# Altium schematic sheet УШЯИ.411618.029Э Э3 Лист 1.schdoc (part 2 of 3)
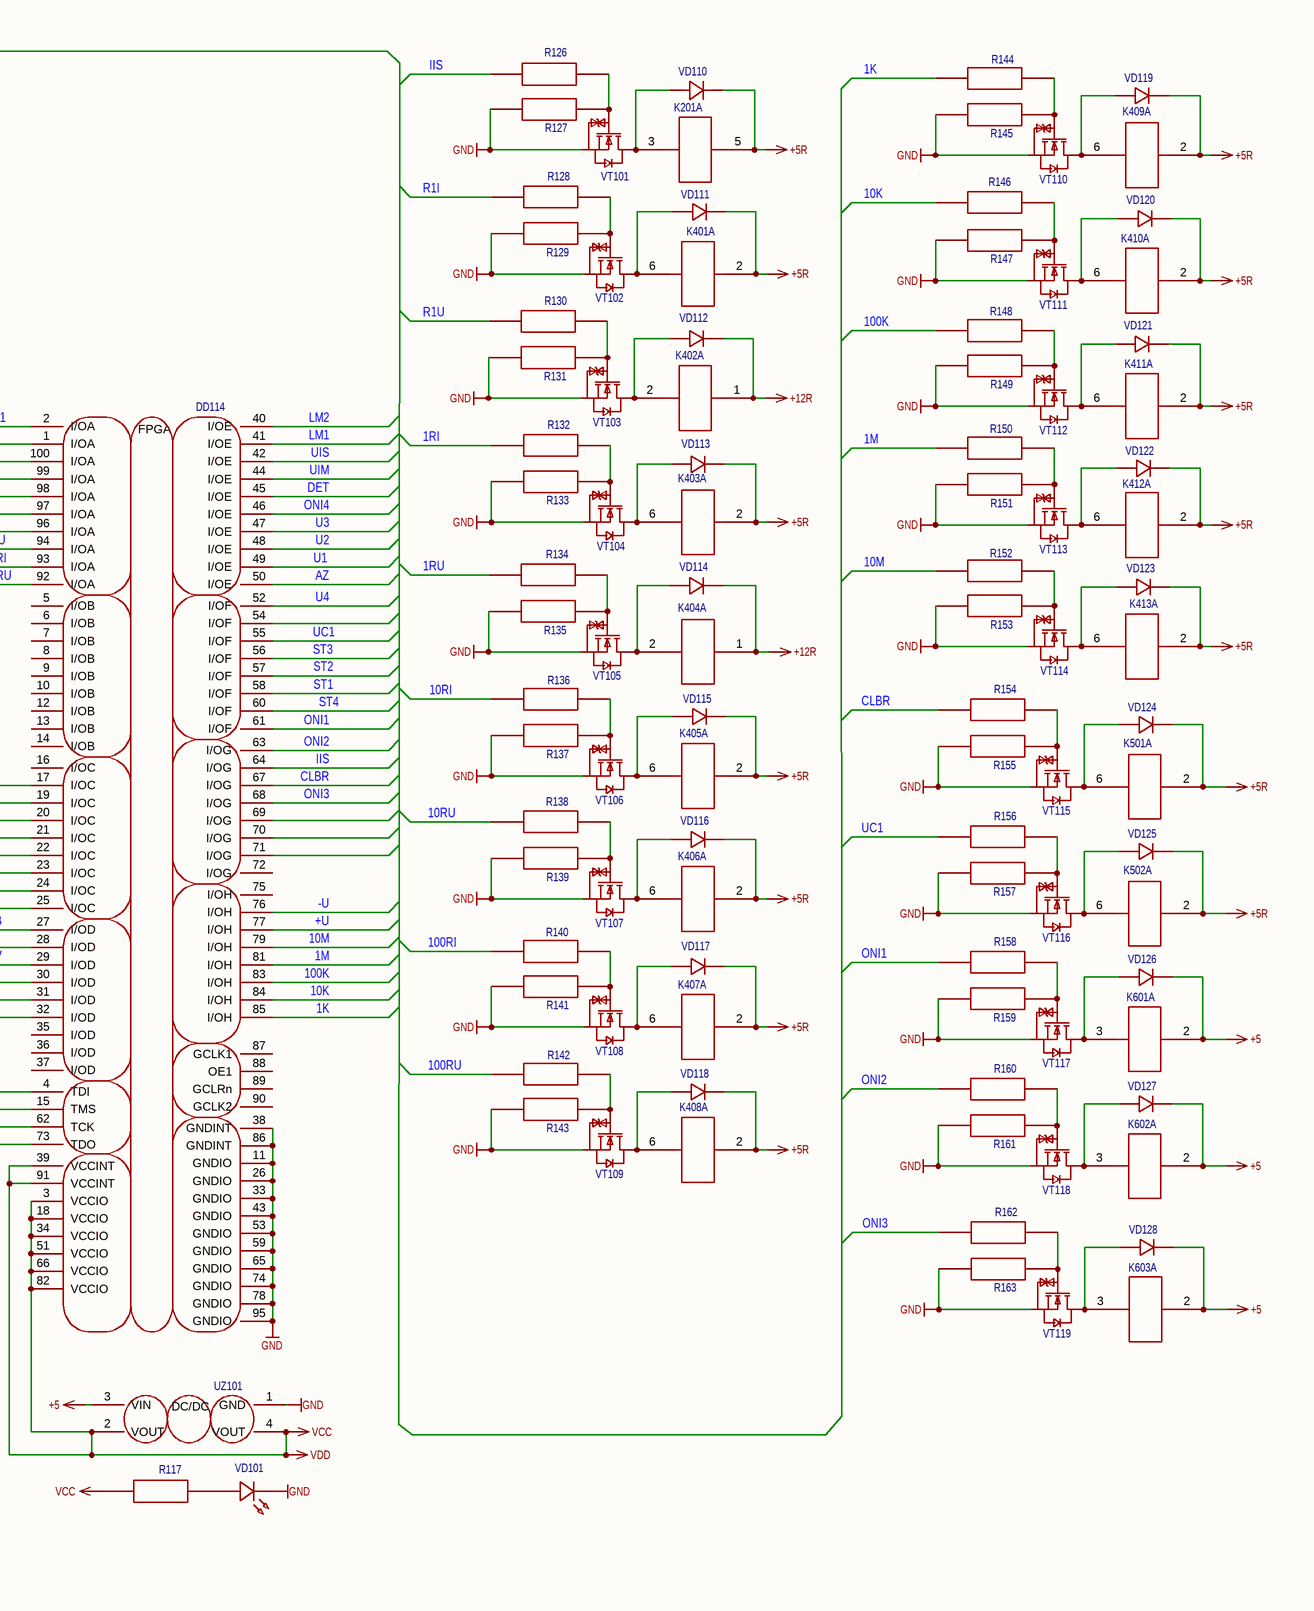
[diagram p2: УШЯИ.411618.029Э Э3 Лист 1.schdoc, right]
## Library data of the parts
C101 = Конденсатор SMD 100нФ 100В X7R 10% [0805]: Contributor: jordanjin; Convert to PCB: yes; UniqueId: gge50a601ba36169810; Origin Footprint: C0805; Device: Конденсатор SMD 100нФ 100В X7R 10% [0805]; Symbol: Конденсатор SMD 100нФ 100В X7R 10% [0805]; Manufacturer Part: C0805; spicePre: C; spiceSymbolName: Конденсатор SMD 100нФ 100В X7R 10% [0805]; Add into BOM: yes; FootprintName: C0805
C102 = Конденсатор SMD 100нФ 100В X7R 10% [0805]: Contributor: jordanjin; Convert to PCB: yes; UniqueId: gge94e2ea0e3b3374a7; Origin Footprint: C0805; Device: Конденсатор SMD 100нФ 100В X7R 10% [0805]; Symbol: Конденсатор SMD 100нФ 100В X7R 10% [0805]; Manufacturer Part: C0805; spicePre: C; spiceSymbolName: Конденсатор SMD 100нФ 100В X7R 10% [0805]; Add into BOM: yes; FootprintName: C0805
C103 = Конденсатор SMD 100нФ 100В X7R 10% [0805]: Contributor: jordanjin; Convert to PCB: yes; UniqueId: ggedacb5201c4a5c4e2; Origin Footprint: C0805; Device: Конденсатор SMD 100нФ 100В X7R 10% [0805]; Symbol: Конденсатор SMD 100нФ 100В X7R 10% [0805]; Manufacturer Part: C0805; spicePre: C; spiceSymbolName: Конденсатор SMD 100нФ 100В X7R 10% [0805]; Add into BOM: yes; FootprintName: C0805
C104 = Конденсатор SMD 100нФ 100В X7R 10% [0805]: Contributor: jordanjin; Convert to PCB: yes; UniqueId: gge34eda7cf9e9ee0fb; Origin Footprint: C0805; Device: Конденсатор SMD 100нФ 100В X7R 10% [0805]; Symbol: Конденсатор SMD 100нФ 100В X7R 10% [0805]; Manufacturer Part: C0805; spicePre: C; spiceSymbolName: Конденсатор SMD 100нФ 100В X7R 10% [0805]; Add into BOM: yes; FootprintName: C0805
C105 = Конденсатор SMD 100нФ 100В X7R 10% [0805]: Contributor: jordanjin; Convert to PCB: yes; UniqueId: gge25c71510294cab0d; Origin Footprint: C0805; Device: Конденсатор SMD 100нФ 100В X7R 10% [0805]; Symbol: Конденсатор SMD 100нФ 100В X7R 10% [0805]; Manufacturer Part: C0805; spicePre: C; spiceSymbolName: Конденсатор SMD 100нФ 100В X7R 10% [0805]; Add into BOM: yes; FootprintName: C0805
C106 = Конденсатор SMD 100нФ 100В X7R 10% [0805]: Contributor: jordanjin; Convert to PCB: yes; UniqueId: gge49d087e124082ea0; Origin Footprint: C0805; Device: Конденсатор SMD 100нФ 100В X7R 10% [0805]; Symbol: Конденсатор SMD 100нФ 100В X7R 10% [0805]; Manufacturer Part: C0805; spicePre: C; spiceSymbolName: Конденсатор SMD 100нФ 100В X7R 10% [0805]; Add into BOM: yes; FootprintName: C0805
C107 = Конденсатор SMD 100нФ 100В X7R 10% [0805]: Contributor: jordanjin; Convert to PCB: yes; UniqueId: gge50cb57ab95e02ebe; Origin Footprint: C0805; Device: Конденсатор SMD 100нФ 100В X7R 10% [0805]; Symbol: Конденсатор SMD 100нФ 100В X7R 10% [0805]; Manufacturer Part: C0805; spicePre: C; spiceSymbolName: Конденсатор SMD 100нФ 100В X7R 10% [0805]; Add into BOM: yes; FootprintName: C0805
C108 = Конденсатор SMD 100нФ 100В X7R 10% [0805]: Contributor: jordanjin; Convert to PCB: yes; UniqueId: gged933a6a0350d5a04; Origin Footprint: C0805; Device: Конденсатор SMD 100нФ 100В X7R 10% [0805]; Symbol: Конденсатор SMD 100нФ 100В X7R 10% [0805]; Manufacturer Part: C0805; spicePre: C; spiceSymbolName: Конденсатор SMD 100нФ 100В X7R 10% [0805]; Add into BOM: yes; FootprintName: C0805
C109 = Конденсатор SMD 100нФ 100В X7R 10% [0805]: Contributor: jordanjin; Convert to PCB: yes; UniqueId: gge27962ba85defdf79; Origin Footprint: C0805; Device: Конденсатор SMD 100нФ 100В X7R 10% [0805]; Symbol: Конденсатор SMD 100нФ 100В X7R 10% [0805]; Manufacturer Part: C0805; spicePre: C; spiceSymbolName: Конденсатор SMD 100нФ 100В X7R 10% [0805]; Add into BOM: yes; FootprintName: C0805
C110 = Конденсатор SMD 100нФ 100В X7R 10% [0805]: Contributor: jordanjin; Convert to PCB: yes; UniqueId: gge612c97588fe9464b; Origin Footprint: C0805; Device: Конденсатор SMD 100нФ 100В X7R 10% [0805]; Symbol: Конденсатор SMD 100нФ 100В X7R 10% [0805]; Manufacturer Part: C0805; spicePre: C; spiceSymbolName: Конденсатор SMD 100нФ 100В X7R 10% [0805]; Add into BOM: yes; FootprintName: C0805
C111 = Конденсатор SMD 100нФ 100В X7R 10% [0805]: Contributor: jordanjin; Convert to PCB: yes; UniqueId: gge2f7a6f25e128a448; Origin Footprint: C0805; Device: Конденсатор SMD 100нФ 100В X7R 10% [0805]; Symbol: Конденсатор SMD 100нФ 100В X7R 10% [0805]; Manufacturer Part: C0805; spicePre: C; spiceSymbolName: Конденсатор SMD 100нФ 100В X7R 10% [0805]; Add into BOM: yes; FootprintName: C0805
C112 = Конденсатор SMD 100нФ 100В X7R 10% [0805]: Contributor: jordanjin; Convert to PCB: yes; UniqueId: gge7a76c4b2d63205ed; Origin Footprint: C0805; Device: Конденсатор SMD 100нФ 100В X7R 10% [0805]; Symbol: Конденсатор SMD 100нФ 100В X7R 10% [0805]; Manufacturer Part: C0805; spicePre: C; spiceSymbolName: Конденсатор SMD 100нФ 100В X7R 10% [0805]; Add into BOM: yes; FootprintName: C0805
C113 = Конденсатор SMD 100нФ 100В X7R 10% [0805]: Contributor: jordanjin; Convert to PCB: yes; UniqueId: gge1b835d6c60b435b0; Origin Footprint: C0805; Device: Конденсатор SMD 100нФ 100В X7R 10% [0805]; Symbol: Конденсатор SMD 100нФ 100В X7R 10% [0805]; Manufacturer Part: C0805; spicePre: C; spiceSymbolName: Конденсатор SMD 100нФ 100В X7R 10% [0805]; Add into BOM: yes; FootprintName: C0805
C114 = Конденсатор SMD 100нФ 100В X7R 10% [0805]: Contributor: jordanjin; Convert to PCB: yes; UniqueId: gged3422836171095bd; Origin Footprint: C0805; Device: Конденсатор SMD 100нФ 100В X7R 10% [0805]; Symbol: Конденсатор SMD 100нФ 100В X7R 10% [0805]; Manufacturer Part: C0805; spicePre: C; spiceSymbolName: Конденсатор SMD 100нФ 100В X7R 10% [0805]; Add into BOM: yes; FootprintName: C0805
C115 = Конденсатор SMD 100нФ 100В X7R 10% [0805]: Contributor: jordanjin; Convert to PCB: yes; UniqueId: gge559d8560901f254c; Origin Footprint: C0805; Device: Конденсатор SMD 100нФ 100В X7R 10% [0805]; Symbol: Конденсатор SMD 100нФ 100В X7R 10% [0805]; Manufacturer Part: C0805; spicePre: C; spiceSymbolName: Конденсатор SMD 100нФ 100В X7R 10% [0805]; Add into BOM: yes; FootprintName: C0805
C116 = Конденсатор SMD 100нФ 100В X7R 10% [0805]: Contributor: jordanjin; Convert to PCB: yes; UniqueId: ggec511750cb831a988; Origin Footprint: C0805; Device: Конденсатор SMD 100нФ 100В X7R 10% [0805]; Symbol: Конденсатор SMD 100нФ 100В X7R 10% [0805]; Manufacturer Part: C0805; spicePre: C; spiceSymbolName: Конденсатор SMD 100нФ 100В X7R 10% [0805]; Add into BOM: yes; FootprintName: C0805
C117 = Конденсатор SMD 100нФ 100В X7R 10% [0805]: Contributor: jordanjin; Convert to PCB: yes; UniqueId: gge492dbba8a9d90766; Origin Footprint: C0805; Device: Конденсатор SMD 100нФ 100В X7R 10% [0805]; Symbol: Конденсатор SMD 100нФ 100В X7R 10% [0805]; Manufacturer Part: C0805; spicePre: C; spiceSymbolName: Конденсатор SMD 100нФ 100В X7R 10% [0805]; Add into BOM: yes; FootprintName: C0805
C118 = Конденсатор SMD 100нФ 100В X7R 10% [0805]: Contributor: jordanjin; Convert to PCB: yes; UniqueId: ggedc3a872f3d7bf9b6; Origin Footprint: C0805; Device: Конденсатор SMD 100нФ 100В X7R 10% [0805]; Symbol: Конденсатор SMD 100нФ 100В X7R 10% [0805]; Manufacturer Part: C0805; spicePre: C; spiceSymbolName: Конденсатор SMD 100нФ 100В X7R 10% [0805]; Add into BOM: yes; FootprintName: C0805
C119 = Конденсатор SMD 100нФ 100В X7R 10% [0805]: Contributor: jordanjin; Convert to PCB: yes; UniqueId: ggea50e830354660b01; Origin Footprint: C0805; Device: Конденсатор SMD 100нФ 100В X7R 10% [0805]; Symbol: Конденсатор SMD 100нФ 100В X7R 10% [0805]; Manufacturer Part: C0805; spicePre: C; spiceSymbolName: Конденсатор SMD 100нФ 100В X7R 10% [0805]; Add into BOM: yes; FootprintName: C0805
C120 = Конденсатор SMD 100нФ 100В X7R 10% [0805]: Contributor: jordanjin; Convert to PCB: yes; UniqueId: gge9590b5d8379a1919; Origin Footprint: C0805; Device: Конденсатор SMD 100нФ 100В X7R 10% [0805]; Symbol: Конденсатор SMD 100нФ 100В X7R 10% [0805]; Manufacturer Part: C0805; spicePre: C; spiceSymbolName: Конденсатор SMD 100нФ 100В X7R 10% [0805]; Add into BOM: yes; FootprintName: C0805
C121 = Конденсатор SMD 100нФ 100В X7R 10% [0805]: Contributor: jordanjin; Convert to PCB: yes; UniqueId: gge63b3ddf0ade3641d; Origin Footprint: C0805; Device: Конденсатор SMD 100нФ 100В X7R 10% [0805]; Symbol: Конденсатор SMD 100нФ 100В X7R 10% [0805]; Manufacturer Part: C0805; spicePre: C; spiceSymbolName: Конденсатор SMD 100нФ 100В X7R 10% [0805]; Add into BOM: yes; FootprintName: C0805
C122 = Конденсатор SMD 100нФ 100В X7R 10% [0805]: Contributor: jordanjin; Convert to PCB: yes; UniqueId: ggeb83b43dba428f6ef; Origin Footprint: C0805; Device: Конденсатор SMD 100нФ 100В X7R 10% [0805]; Symbol: Конденсатор SMD 100нФ 100В X7R 10% [0805]; Manufacturer Part: C0805; spicePre: C; spiceSymbolName: Конденсатор SMD 100нФ 100В X7R 10% [0805]; Add into BOM: yes; FootprintName: C0805
C123 = Конденсатор SMD 100нФ 100В X7R 10% [0805]: Contributor: jordanjin; Convert to PCB: yes; UniqueId: ggea2a125f1a1054dbe; Origin Footprint: C0805; Device: Конденсатор SMD 100нФ 100В X7R 10% [0805]; Symbol: Конденсатор SMD 100нФ 100В X7R 10% [0805]; Manufacturer Part: C0805; spicePre: C; spiceSymbolName: Конденсатор SMD 100нФ 100В X7R 10% [0805]; Add into BOM: yes; FootprintName: C0805
C124 = Конденсатор SMD 100нФ 100В X7R 10% [0805]: Contributor: jordanjin; Convert to PCB: yes; UniqueId: gge87e42572fc320fa7; Origin Footprint: C0805; Device: Конденсатор SMD 100нФ 100В X7R 10% [0805]; Symbol: Конденсатор SMD 100нФ 100В X7R 10% [0805]; Manufacturer Part: C0805; spicePre: C; spiceSymbolName: Конденсатор SMD 100нФ 100В X7R 10% [0805]; Add into BOM: yes; FootprintName: C0805
C125 = Конденсатор SMD 100нФ 100В X7R 10% [0805]: Contributor: jordanjin; Convert to PCB: yes; UniqueId: ggea9bf1272ff874ec4; Origin Footprint: C0805; Device: Конденсатор SMD 100нФ 100В X7R 10% [0805]; Symbol: Конденсатор SMD 100нФ 100В X7R 10% [0805]; Manufacturer Part: C0805; spicePre: C; spiceSymbolName: Конденсатор SMD 100нФ 100В X7R 10% [0805]; Add into BOM: yes; FootprintName: C0805
C126 = Конденсатор SMD 100нФ 100В X7R 10% [0805]: Contributor: jordanjin; Convert to PCB: yes; UniqueId: ggec79572819af15c76; Origin Footprint: C0805; Device: Конденсатор SMD 100нФ 100В X7R 10% [0805]; Symbol: Конденсатор SMD 100нФ 100В X7R 10% [0805]; Manufacturer Part: C0805; spicePre: C; spiceSymbolName: Конденсатор SMD 100нФ 100В X7R 10% [0805]; Add into BOM: yes; FootprintName: C0805
C127 = TECAP, 100мкФ, 10В, тип C: Manufacturer: Kyocera AVX; nameAlias: Value; Contributor: jordanjin; Convert to PCB: yes; UniqueId: gge1274122329830bad; Origin Footprint: CASE-C_6032; Device: TECAP, 100мкФ, 10В, тип C; Symbol: TECAP, 100мкФ, 10В, тип C; Supplier: LCSC; Supplier Part: C273664; Manufacturer Part: TECAP, 100мкФ, 10В, тип C; JLCPCB Part Class: Extended Part; spicePre: C; spiceSymbolName: TECAP, 100мкФ, 10В, тип C; Add into BOM: yes; FootprintName: CASE-C_6032
C128 = Конденсатор SMD 10мкФ 100В X7R 10% [0805]: Contributor: jordanjin; Convert to PCB: yes; UniqueId: gge114f7bd3638c32e8; Origin Footprint: C0805; Device: Конденсатор SMD 10мкФ 100В X7R 10% [0805]; Symbol: Конденсатор SMD 10мкФ 100В X7R 10% [0805]; Manufacturer Part: C0805; spicePre: C; spiceSymbolName: Конденсатор SMD 100нФ 100В X7R 10% [0805]; Add into BOM: yes; FootprintName: C0805
C129 = Конденсатор SMD 100нФ 100В X7R 10% [0805]: Contributor: jordanjin; Convert to PCB: yes; UniqueId: ggeb629d3a449f0ebd6; Origin Footprint: C0805; Device: Конденсатор SMD 100нФ 100В X7R 10% [0805]; Symbol: Конденсатор SMD 100нФ 100В X7R 10% [0805]; Manufacturer Part: C0805; spicePre: C; spiceSymbolName: Конденсатор SMD 100нФ 100В X7R 10% [0805]; Add into BOM: yes; FootprintName: C0805
C130 = Конденсатор SMD 100нФ 100В X7R 10% [0805]: Contributor: jordanjin; Convert to PCB: yes; UniqueId: gge720601326cec92c7; Origin Footprint: C0805; Device: Конденсатор SMD 100нФ 100В X7R 10% [0805]; Symbol: Конденсатор SMD 100нФ 100В X7R 10% [0805]; Manufacturer Part: C0805; spicePre: C; spiceSymbolName: Конденсатор SMD 100нФ 100В X7R 10% [0805]; Add into BOM: yes; FootprintName: C0805
C131 = Конденсатор SMD 100нФ 100В X7R 10% [0805]: Contributor: jordanjin; Convert to PCB: yes; UniqueId: gge93f31df730ba0f33; Origin Footprint: C0805; Device: Конденсатор SMD 100нФ 100В X7R 10% [0805]; Symbol: Конденсатор SMD 100нФ 100В X7R 10% [0805]; Manufacturer Part: C0805; spicePre: C; spiceSymbolName: Конденсатор SMD 100нФ 100В X7R 10% [0805]; Add into BOM: yes; FootprintName: C0805
C132 = Конденсатор SMD 100нФ 100В X7R 10% [0805]: Contributor: jordanjin; Convert to PCB: yes; UniqueId: ggeb7d0df687c6811f3; Origin Footprint: C0805; Device: Конденсатор SMD 100нФ 100В X7R 10% [0805]; Symbol: Конденсатор SMD 100нФ 100В X7R 10% [0805]; Manufacturer Part: C0805; spicePre: C; spiceSymbolName: Конденсатор SMD 100нФ 100В X7R 10% [0805]; Add into BOM: yes; FootprintName: C0805
C133 = Конденсатор SMD 100нФ 100В X7R 10% [0805]: Contributor: jordanjin; Convert to PCB: yes; UniqueId: ggeda150ecc94310c71; Origin Footprint: C0805; Device: Конденсатор SMD 100нФ 100В X7R 10% [0805]; Symbol: Конденсатор SMD 100нФ 100В X7R 10% [0805]; Manufacturer Part: C0805; spicePre: C; spiceSymbolName: Конденсатор SMD 100нФ 100В X7R 10% [0805]; Add into BOM: yes; FootprintName: C0805
C134 = Конденсатор SMD 100нФ 100В X7R 10% [0805]: Contributor: jordanjin; Convert to PCB: yes; UniqueId: gge45b133ad58b3c6cc; Origin Footprint: C0805; Device: Конденсатор SMD 100нФ 100В X7R 10% [0805]; Symbol: Конденсатор SMD 100нФ 100В X7R 10% [0805]; Manufacturer Part: C0805; spicePre: C; spiceSymbolName: Конденсатор SMD 100нФ 100В X7R 10% [0805]; Add into BOM: yes; FootprintName: C0805
C135 = Конденсатор SMD 100нФ 100В X7R 10% [0805]: Contributor: jordanjin; Convert to PCB: yes; UniqueId: gge8cfa1b9352ccbfc1; Origin Footprint: C0805; Device: Конденсатор SMD 100нФ 100В X7R 10% [0805]; Symbol: Конденсатор SMD 100нФ 100В X7R 10% [0805]; Manufacturer Part: C0805; spicePre: C; spiceSymbolName: Конденсатор SMD 100нФ 100В X7R 10% [0805]; Add into BOM: yes; FootprintName: C0805
C136 = Конденсатор SMD 100нФ 100В X7R 10% [0805]: Contributor: jordanjin; Convert to PCB: yes; UniqueId: gge177eba0eb34f5c30; Origin Footprint: C0805; Device: Конденсатор SMD 100нФ 100В X7R 10% [0805]; Symbol: Конденсатор SMD 100нФ 100В X7R 10% [0805]; Manufacturer Part: C0805; spicePre: C; spiceSymbolName: Конденсатор SMD 100нФ 100В X7R 10% [0805]; Add into BOM: yes; FootprintName: C0805
DD101 = Изолированный приемопередатчик ADM2486BRWZ-REEL [SOIC-16]: Manufacturer: Analog Devices; Contributor: jordanjin; Convert to PCB: yes; UniqueId: gge280670cf599e4aa0; Origin Footprint: SOIC-16_L10.3-W7.5-P1.27-LS10.3-BL; Device: Изолированный приемопередатчик ADM2486BRWZ-REEL [SOIC-16]; Symbol: Изолированный приемопередатчик ADM2486BRWZ-REEL [SOIC-16]; Supplier: LCSC; Manufacturer Part: ADM2486BRWZ-REEL; JLCPCB Part Class: Extended Part; spicePre: D; spiceSymbolName: ADM2486BRWZ-REEL; Add into BOM: yes; FootprintName: SOIC-16_L10.3-W7.5-P1.27-LS10.3-BL
DD102 = Изолированный приемопередатчик ADM2486BRWZ-REEL [SOIC-16]: Manufacturer: Analog Devices; Contributor: jordanjin; Convert to PCB: yes; UniqueId: ggee281b66250e43b86; Origin Footprint: SOIC-16_L10.3-W7.5-P1.27-LS10.3-BL; Device: Изолированный приемопередатчик ADM2486BRWZ-REEL [SOIC-16]; Symbol: Изолированный приемопередатчик ADM2486BRWZ-REEL [SOIC-16]; Supplier: LCSC; Manufacturer Part: ADM2486BRWZ-REEL; JLCPCB Part Class: Extended Part; spicePre: D; spiceSymbolName: ADM2486BRWZ-REEL; Add into BOM: yes; FootprintName: SOIC-16_L10.3-W7.5-P1.27-LS10.3-BL
DD103 = Высокоскоростной цифровой изолятор ADUM1100BRZ-RL7 [SOIC-8]: Manufacturer: Analog Devices; Manufacturer Part: ADUM1100ARZ; Contributor: jordanjin; Convert to PCB: yes; UniqueId: gged390e51bf4fd7430; Origin Footprint: SOIC-8_L4.9-W3.9-P1.27-LS6.0-BL; Device: Высокоскоростной цифровой изолятор ADUM1100BRZ-RL7 [SOIC-8]; Symbol: Высокоскоростной цифровой изолятор ADUM1100BRZ-RL7 [SOIC-8]; Supplier: LCSC; JLCPCB Part Class: Extended Part; spicePre: D; spiceSymbolName: Высокоскоростной цифровой изолятор ADUM1100BRZ-RL7 [SOIC-8]; Add into BOM: yes; FootprintName: SOIC-8_L4.9-W3.9-P1.27-LS6.0-BL
DD104 = Высокоскоростной цифровой изолятор ADUM1100BRZ-RL7 [SOIC-8]: Manufacturer: Analog Devices; Manufacturer Part: ADUM1100ARZ; Contributor: jordanjin; Convert to PCB: yes; UniqueId: ggefa5c6f2ce462c50e; Origin Footprint: SOIC-8_L4.9-W3.9-P1.27-LS6.0-BL; Device: Высокоскоростной цифровой изолятор ADUM1100BRZ-RL7 [SOIC-8]; Symbol: Высокоскоростной цифровой изолятор ADUM1100BRZ-RL7 [SOIC-8]; Supplier: LCSC; JLCPCB Part Class: Extended Part; spicePre: D; spiceSymbolName: Высокоскоростной цифровой изолятор ADUM1100BRZ-RL7 [SOIC-8]; Add into BOM: yes; FootprintName: SOIC-8_L4.9-W3.9-P1.27-LS6.0-BL
DD105 = Высокоскоростной цифровой изолятор ADUM1100BRZ-RL7 [SOIC-8]: Manufacturer: Analog Devices; Manufacturer Part: ADUM1100ARZ; Contributor: jordanjin; Convert to PCB: yes; UniqueId: gge7937ef05f563b8cc; Origin Footprint: SOIC-8_L4.9-W3.9-P1.27-LS6.0-BL; Device: Высокоскоростной цифровой изолятор ADUM1100BRZ-RL7 [SOIC-8]; Symbol: Высокоскоростной цифровой изолятор ADUM1100BRZ-RL7 [SOIC-8]; Supplier: LCSC; JLCPCB Part Class: Extended Part; spicePre: D; spiceSymbolName: Высокоскоростной цифровой изолятор ADUM1100BRZ-RL7 [SOIC-8]; Add into BOM: yes; FootprintName: SOIC-8_L4.9-W3.9-P1.27-LS6.0-BL
DD106 = Изолированный приемопередатчик ADM2486BRWZ-REEL [SOIC-16]: Manufacturer: Analog Devices; Contributor: jordanjin; Convert to PCB: yes; UniqueId: gge233945d82e3d21a8; Origin Footprint: SOIC-16_L10.3-W7.5-P1.27-LS10.3-BL; Device: Изолированный приемопередатчик ADM2486BRWZ-REEL [SOIC-16]; Symbol: Изолированный приемопередатчик ADM2486BRWZ-REEL [SOIC-16]; Supplier: LCSC; Manufacturer Part: ADM2486BRWZ-REEL; JLCPCB Part Class: Extended Part; spicePre: D; spiceSymbolName: ADM2486BRWZ-REEL; Add into BOM: yes; FootprintName: SOIC-16_L10.3-W7.5-P1.27-LS10.3-BL
DD107 = Изолированный приемопередатчик ADM2486BRWZ-REEL [SOIC-16]: Manufacturer: Analog Devices; Contributor: jordanjin; Convert to PCB: yes; UniqueId: ggebc0a98823a54ad10; Origin Footprint: SOIC-16_L10.3-W7.5-P1.27-LS10.3-BL; Device: Изолированный приемопередатчик ADM2486BRWZ-REEL [SOIC-16]; Symbol: Изолированный приемопередатчик ADM2486BRWZ-REEL [SOIC-16]; Supplier: LCSC; Manufacturer Part: ADM2486BRWZ-REEL; JLCPCB Part Class: Extended Part; spicePre: D; spiceSymbolName: ADM2486BRWZ-REEL; Add into BOM: yes; FootprintName: SOIC-16_L10.3-W7.5-P1.27-LS10.3-BL
DD108 = Изолированный приемопередатчик ADM2486BRWZ-REEL [SOIC-16]: Manufacturer: Analog Devices; Contributor: jordanjin; Convert to PCB: yes; UniqueId: gge3fd088e38cfc0ffe; Origin Footprint: SOIC-16_L10.3-W7.5-P1.27-LS10.3-BL; Device: Изолированный приемопередатчик ADM2486BRWZ-REEL [SOIC-16]; Symbol: Изолированный приемопередатчик ADM2486BRWZ-REEL [SOIC-16]; Supplier: LCSC; Manufacturer Part: ADM2486BRWZ-REEL; JLCPCB Part Class: Extended Part; spicePre: D; spiceSymbolName: ADM2486BRWZ-REEL; Add into BOM: yes; FootprintName: SOIC-16_L10.3-W7.5-P1.27-LS10.3-BL
DD109 = Высокоскоростной цифровой изолятор ADUM1100BRZ-RL7 [SOIC-8]: Manufacturer: Analog Devices; Manufacturer Part: ADUM1100ARZ; Contributor: jordanjin; Convert to PCB: yes; UniqueId: gge02d54f2b020cfd78; Origin Footprint: SOIC-8_L4.9-W3.9-P1.27-LS6.0-BL; Device: Высокоскоростной цифровой изолятор ADUM1100BRZ-RL7 [SOIC-8]; Symbol: Высокоскоростной цифровой изолятор ADUM1100BRZ-RL7 [SOIC-8]; Supplier: LCSC; JLCPCB Part Class: Extended Part; spicePre: D; spiceSymbolName: Высокоскоростной цифровой изолятор ADUM1100BRZ-RL7 [SOIC-8]; Add into BOM: yes; FootprintName: SOIC-8_L4.9-W3.9-P1.27-LS6.0-BL
DD110 = Изолированный приемопередатчик ADM2486BRWZ-REEL [SOIC-16]: Manufacturer: Analog Devices; Contributor: jordanjin; Convert to PCB: yes; UniqueId: gge7962ba2743f0d233; Origin Footprint: SOIC-16_L10.3-W7.5-P1.27-LS10.3-BL; Device: Изолированный приемопередатчик ADM2486BRWZ-REEL [SOIC-16]; Symbol: Изолированный приемопередатчик ADM2486BRWZ-REEL [SOIC-16]; Supplier: LCSC; Manufacturer Part: ADM2486BRWZ-REEL; JLCPCB Part Class: Extended Part; spicePre: D; spiceSymbolName: ADM2486BRWZ-REEL; Add into BOM: yes; FootprintName: SOIC-16_L10.3-W7.5-P1.27-LS10.3-BL
DD111 = Высокоскоростной цифровой изолятор ADUM1100BRZ-RL7 [SOIC-8]: Manufacturer: Analog Devices; Manufacturer Part: ADUM1100ARZ; Contributor: jordanjin; Convert to PCB: yes; UniqueId: gge672aa3b78a0e2831; Origin Footprint: SOIC-8_L4.9-W3.9-P1.27-LS6.0-BL; Device: Высокоскоростной цифровой изолятор ADUM1100BRZ-RL7 [SOIC-8]; Symbol: Высокоскоростной цифровой изолятор ADUM1100BRZ-RL7 [SOIC-8]; Supplier: LCSC; JLCPCB Part Class: Extended Part; spicePre: D; spiceSymbolName: Высокоскоростной цифровой изолятор ADUM1100BRZ-RL7 [SOIC-8]; Add into BOM: yes; FootprintName: SOIC-8_L4.9-W3.9-P1.27-LS6.0-BL
DD112 = Высокоскоростной цифровой изолятор ADUM1100BRZ-RL7 [SOIC-8]: Manufacturer: Analog Devices; Manufacturer Part: ADUM1100ARZ; Contributor: jordanjin; Convert to PCB: yes; UniqueId: gge049ba3f92aabc7b6; Origin Footprint: SOIC-8_L4.9-W3.9-P1.27-LS6.0-BL; Device: Высокоскоростной цифровой изолятор ADUM1100BRZ-RL7 [SOIC-8]; Symbol: Высокоскоростной цифровой изолятор ADUM1100BRZ-RL7 [SOIC-8]; Supplier: LCSC; JLCPCB Part Class: Extended Part; spicePre: D; spiceSymbolName: Высокоскоростной цифровой изолятор ADUM1100BRZ-RL7 [SOIC-8]; Add into BOM: yes; FootprintName: SOIC-8_L4.9-W3.9-P1.27-LS6.0-BL
DD113 = Высокоскоростной цифровой изолятор ADUM1100BRZ-RL7 [SOIC-8]: Manufacturer: Analog Devices; Manufacturer Part: ADUM1100ARZ; Contributor: jordanjin; Convert to PCB: yes; UniqueId: gge467b7f9dac9089db; Origin Footprint: SOIC-8_L4.9-W3.9-P1.27-LS6.0-BL; Device: Высокоскоростной цифровой изолятор ADUM1100BRZ-RL7 [SOIC-8]; Symbol: Высокоскоростной цифровой изолятор ADUM1100BRZ-RL7 [SOIC-8]; Supplier: LCSC; JLCPCB Part Class: Extended Part; spicePre: D; spiceSymbolName: Высокоскоростной цифровой изолятор ADUM1100BRZ-RL7 [SOIC-8]; Add into BOM: yes; FootprintName: SOIC-8_L4.9-W3.9-P1.27-LS6.0-BL
DD114 = ПЛИС EPM3128ATC100-10N [TQFP-100]: Manufacturer: Intel/Altera; Contributor: jordanjin; Convert to PCB: yes; UniqueId: gge69bfa431c52bedcc; Origin Footprint: TQFP-100_L14.0-W14.0-P0.50-LS16.0-BL; Device: ПЛИС EPM3128ATC100-10N [TQFP-100]; Symbol: ПЛИС EPM3128ATC100-10N [TQFP-100]; spicePre: X; Supplier: LCSC; Manufacturer Part: EPM3128ATC100-10N; JLCPCB Part Class: Extended Part; spiceSymbolName: ПЛИС EPM3128ATC100-10N [TQFP-100]; Add into BOM: yes; FootprintName: TQFP-100_L14.0-W14.0-P0.50-LS16.0-BL
K201 = Реле герконовое SIL05-1A72-71L [PCB]: Manufacturer: STANDEXMEDER; subpart_no: 1; Origin Footprint: RELAY-TH_4P-L20.6-W5.9_STANDEXMEDER_SIL12-1A72-71L; Contributor: jordanjin; Convert to PCB: yes; UniqueId: gge5a920c36dc7e1466; ModelId: 7150b5ec7bbe4c7fa168fd25340efd63; Device: Реле герконовое SIL05-1A72-71L [PCB]; Symbol: Реле герконовое SIL05-1A72-71L [PCB]; Supplier: LCSC; Manufacturer Part: SIL05-1A72-71L; JLCPCB Part Class: Extended Part; spicePre: K; spiceSymbolName: Реле герконовое SIL05-1A72-71L [PCB]; Add into BOM: yes; FootprintName: RELAY-TH_4P-L20.6-W5.9_STANDEXMEDER_SIL12-1A72-71L; ModelName: RELAY-TH_4P-L20.6-W5.9_STANDEXMEDER_SIL12-1A72-71L
K401 = Реле герконовое DIP05-1A72-13L  [PCB]: Manufacturer: STANDEXMEDER; subpart_no: 1; Contributor: jordanjin; Convert to PCB: yes; UniqueId: ggea45fc22cc44c2d75; Origin Footprint: RELAY-TH_STANDEXMEDER_DIP05-1A72-13L; Device: Реле герконовое DIP05-1A72-13L  [PCB]; Symbol: Реле герконовое DIP05-1A72-13L  [PCB]; Supplier: LCSC; Supplier Part: C1524853; Manufacturer Part: DIP05-1A72-13L; JLCPCB Part Class: Extended Part; spicePre: K; spiceSymbolName: Реле герконовое DIP05-1A72-13L  [PCB]; Add into BOM: yes; FootprintName: RELAY-TH_STANDEXMEDER_DIP05-1A72-13L
K402 = Реле герконовое УШЯИ.685442.092 (2 реле): Manufacturer: ОАО"МНИПИ"; Part Number: 1; Origin Footprint: УШЯИ.685442.092 В2; Contributor: jordanjin; Convert to PCB: yes; UniqueId: ggedd096f2fa000e1a3; Device: Реле герконовое УШЯИ.685442.092 (2 реле); Symbol: Реле герконовое УШЯИ.685442.092 (2 реле); Supplier: LCSC; Manufacturer Part: УШЯИ.685442.092; Subpart_no: 1; Add into BOM: yes; spicePre: K; spiceSymbolName: Реле герконовое УШЯИ.685442.092 (2 реле)
K403 = Реле герконовое DIP05-1A72-13L  [PCB]: Manufacturer: STANDEXMEDER; subpart_no: 1; Contributor: jordanjin; Convert to PCB: yes; UniqueId: gge7b256544bc94d3e2; Origin Footprint: RELAY-TH_STANDEXMEDER_DIP05-1A72-13L; Device: Реле герконовое DIP05-1A72-13L  [PCB]; Symbol: Реле герконовое DIP05-1A72-13L  [PCB]; Supplier: LCSC; Supplier Part: C1524853; Manufacturer Part: DIP05-1A72-13L; JLCPCB Part Class: Extended Part; spicePre: K; spiceSymbolName: Реле герконовое DIP05-1A72-13L  [PCB]; Add into BOM: yes; FootprintName: RELAY-TH_STANDEXMEDER_DIP05-1A72-13L
K404 = Реле герконовое УШЯИ.685442.092 (1 реле): Manufacturer: ОАО"МНИПИ"; subpart_no: 1; Contributor: jordanjin; Convert to PCB: yes; UniqueId: ggec0474dfb349761fe; Origin Footprint: УШЯИ.685442.092; Device: Реле герконовое УШЯИ.685442.092 (1 реле); Symbol: Реле герконовое УШЯИ.685442.092 (1 реле); Supplier: LCSC; Manufacturer Part: УШЯИ.685442.092; JLCPCB Part Class: Extended Part; spicePre: K; spiceSymbolName: Реле герконовое УШЯИ.685442.092 (1 реле); Add into BOM: yes
K405 = Реле герконовое DIP05-1A72-13L  [PCB]: Manufacturer: STANDEXMEDER; subpart_no: 1; Contributor: jordanjin; Convert to PCB: yes; UniqueId: gge1f76a7dc702d7620; Origin Footprint: RELAY-TH_STANDEXMEDER_DIP05-1A72-13L; Device: Реле герконовое DIP05-1A72-13L  [PCB]; Symbol: Реле герконовое DIP05-1A72-13L  [PCB]; Supplier: LCSC; Supplier Part: C1524853; Manufacturer Part: DIP05-1A72-13L; JLCPCB Part Class: Extended Part; spicePre: K; spiceSymbolName: Реле герконовое DIP05-1A72-13L  [PCB]; Add into BOM: yes; FootprintName: RELAY-TH_STANDEXMEDER_DIP05-1A72-13L
K406 = Реле герконовое DIP05-1A72-13L  [PCB]: Manufacturer: STANDEXMEDER; subpart_no: 1; Contributor: jordanjin; Convert to PCB: yes; UniqueId: gge00973bedd4b06ae6; Origin Footprint: RELAY-TH_STANDEXMEDER_DIP05-1A72-13L; Device: Реле герконовое DIP05-1A72-13L  [PCB]; Symbol: Реле герконовое DIP05-1A72-13L  [PCB]; Supplier: LCSC; Supplier Part: C1524853; Manufacturer Part: DIP05-1A72-13L; JLCPCB Part Class: Extended Part; spicePre: K; spiceSymbolName: Реле герконовое DIP05-1A72-13L  [PCB]; Add into BOM: yes; FootprintName: RELAY-TH_STANDEXMEDER_DIP05-1A72-13L
K407 = Реле герконовое DIP05-1A72-13L  [PCB]: Manufacturer: STANDEXMEDER; subpart_no: 1; Contributor: jordanjin; Convert to PCB: yes; UniqueId: gge7eb223ed67f315be; Origin Footprint: RELAY-TH_STANDEXMEDER_DIP05-1A72-13L; Device: Реле герконовое DIP05-1A72-13L  [PCB]; Symbol: Реле герконовое DIP05-1A72-13L  [PCB]; Supplier: LCSC; Supplier Part: C1524853; Manufacturer Part: DIP05-1A72-13L; JLCPCB Part Class: Extended Part; spicePre: K; spiceSymbolName: Реле герконовое DIP05-1A72-13L  [PCB]; Add into BOM: yes; FootprintName: RELAY-TH_STANDEXMEDER_DIP05-1A72-13L
K408 = Реле герконовое DIP05-1A72-13L  [PCB]: Manufacturer: STANDEXMEDER; subpart_no: 1; Contributor: jordanjin; Convert to PCB: yes; UniqueId: ggea0a2675062cebf5e; Origin Footprint: RELAY-TH_STANDEXMEDER_DIP05-1A72-13L; Device: Реле герконовое DIP05-1A72-13L  [PCB]; Symbol: Реле герконовое DIP05-1A72-13L  [PCB]; Supplier: LCSC; Supplier Part: C1524853; Manufacturer Part: DIP05-1A72-13L; JLCPCB Part Class: Extended Part; spicePre: K; spiceSymbolName: Реле герконовое DIP05-1A72-13L  [PCB]; Add into BOM: yes; FootprintName: RELAY-TH_STANDEXMEDER_DIP05-1A72-13L
K409 = Реле герконовое DIP05-1A72-13L  [PCB]: Manufacturer: STANDEXMEDER; subpart_no: 1; Contributor: jordanjin; Convert to PCB: yes; UniqueId: ggee83d63be2b7c682e; Origin Footprint: RELAY-TH_STANDEXMEDER_DIP05-1A72-13L; Device: Реле герконовое DIP05-1A72-13L  [PCB]; Symbol: Реле герконовое DIP05-1A72-13L  [PCB]; Supplier: LCSC; Supplier Part: C1524853; Manufacturer Part: DIP05-1A72-13L; JLCPCB Part Class: Extended Part; spicePre: K; spiceSymbolName: Реле герконовое DIP05-1A72-13L  [PCB]; Add into BOM: yes; FootprintName: RELAY-TH_STANDEXMEDER_DIP05-1A72-13L
K410 = Реле герконовое DIP05-1A72-13L  [PCB]: Manufacturer: STANDEXMEDER; subpart_no: 1; Contributor: jordanjin; Convert to PCB: yes; UniqueId: gge77497d8361c4598c; Origin Footprint: RELAY-TH_STANDEXMEDER_DIP05-1A72-13L; Device: Реле герконовое DIP05-1A72-13L  [PCB]; Symbol: Реле герконовое DIP05-1A72-13L  [PCB]; Supplier: LCSC; Supplier Part: C1524853; Manufacturer Part: DIP05-1A72-13L; JLCPCB Part Class: Extended Part; spicePre: K; spiceSymbolName: Реле герконовое DIP05-1A72-13L  [PCB]; Add into BOM: yes; FootprintName: RELAY-TH_STANDEXMEDER_DIP05-1A72-13L
K411 = Реле герконовое DIP05-1A72-13L  [PCB]: Manufacturer: STANDEXMEDER; subpart_no: 1; Contributor: jordanjin; Convert to PCB: yes; UniqueId: gge695ef8e117c221b6; Origin Footprint: RELAY-TH_STANDEXMEDER_DIP05-1A72-13L; Device: Реле герконовое DIP05-1A72-13L  [PCB]; Symbol: Реле герконовое DIP05-1A72-13L  [PCB]; Supplier: LCSC; Supplier Part: C1524853; Manufacturer Part: DIP05-1A72-13L; JLCPCB Part Class: Extended Part; spicePre: K; spiceSymbolName: Реле герконовое DIP05-1A72-13L  [PCB]; Add into BOM: yes; FootprintName: RELAY-TH_STANDEXMEDER_DIP05-1A72-13L
K412 = Реле герконовое DIP05-1A72-13L  [PCB]: Manufacturer: STANDEXMEDER; subpart_no: 1; Contributor: jordanjin; Convert to PCB: yes; UniqueId: ggef9bf3a281ed54a33; Origin Footprint: RELAY-TH_STANDEXMEDER_DIP05-1A72-13L; Device: Реле герконовое DIP05-1A72-13L  [PCB]; Symbol: Реле герконовое DIP05-1A72-13L  [PCB]; Supplier: LCSC; Supplier Part: C1524853; Manufacturer Part: DIP05-1A72-13L; JLCPCB Part Class: Extended Part; spicePre: K; spiceSymbolName: Реле герконовое DIP05-1A72-13L  [PCB]; Add into BOM: yes; FootprintName: RELAY-TH_STANDEXMEDER_DIP05-1A72-13L
K413 = Реле герконовое DIP05-1A72-13L  [PCB]: Manufacturer: STANDEXMEDER; subpart_no: 1; Contributor: jordanjin; Convert to PCB: yes; UniqueId: gge75a4dccec15134f1; Origin Footprint: RELAY-TH_STANDEXMEDER_DIP05-1A72-13L; Device: Реле герконовое DIP05-1A72-13L  [PCB]; Symbol: Реле герконовое DIP05-1A72-13L  [PCB]; Supplier: LCSC; Supplier Part: C1524853; Manufacturer Part: DIP05-1A72-13L; JLCPCB Part Class: Extended Part; spicePre: K; spiceSymbolName: Реле герконовое DIP05-1A72-13L  [PCB]; Add into BOM: yes; FootprintName: RELAY-TH_STANDEXMEDER_DIP05-1A72-13L
K501 = Реле герконовое DIP05-1A72-13L  [PCB]: Manufacturer: STANDEXMEDER; subpart_no: 1; Contributor: jordanjin; Convert to PCB: yes; UniqueId: ggee1438345d4d73398; Origin Footprint: RELAY-TH_STANDEXMEDER_DIP05-1A72-13L; Device: Реле герконовое DIP05-1A72-13L  [PCB]; Symbol: Реле герконовое DIP05-1A72-13L  [PCB]; Supplier: LCSC; Supplier Part: C1524853; Manufacturer Part: DIP05-1A72-13L; JLCPCB Part Class: Extended Part; spicePre: K; spiceSymbolName: Реле герконовое DIP05-1A72-13L  [PCB]; Add into BOM: yes; FootprintName: RELAY-TH_STANDEXMEDER_DIP05-1A72-13L
K502 = Реле герконовое DIP05-1A72-13L  [PCB]: Manufacturer: STANDEXMEDER; subpart_no: 1; Contributor: jordanjin; Convert to PCB: yes; UniqueId: ggee8b9abbf2c4f7e1a; Origin Footprint: RELAY-TH_STANDEXMEDER_DIP05-1A72-13L; Device: Реле герконовое DIP05-1A72-13L  [PCB]; Symbol: Реле герконовое DIP05-1A72-13L  [PCB]; Supplier: LCSC; Supplier Part: C1524853; Manufacturer Part: DIP05-1A72-13L; JLCPCB Part Class: Extended Part; spicePre: K; spiceSymbolName: Реле герконовое DIP05-1A72-13L  [PCB]; Add into BOM: yes; FootprintName: RELAY-TH_STANDEXMEDER_DIP05-1A72-13L
K601 = Реле герконовое DIP05-1C90-51L [PCB]: Manufacturer: STANDEXMEDER; subpart_no: 1; Origin Footprint: RELAY-TH_STANDEXMEDER_DIP05-1C90-51L; Contributor: jordanjin; Convert to PCB: yes; UniqueId: ggef1f82220597a25dc; ModelId: 9ce20f042c4243a9be1ebcff3b9f4bf9; Device: Реле герконовое DIP05-1C90-51L [PCB]; Symbol: Реле герконовое DIP05-1C90-51L [PCB]; Supplier: LCSC; Manufacturer Part: DIP05-1C90-51L; JLCPCB Part Class: Extended Part; spicePre: K; spiceSymbolName: Реле герконовое DIP05-1C90-51L [PCB]; Add into BOM: yes; FootprintName: RELAY-TH_STANDEXMEDER_DIP05-1C90-51L; ModelName: RELAY-TH_STANDEXMEDER_DIP05-1C90-51L
K602 K603 = Реле герконовое DIP05-1C90-51L [PCB]: Manufacturer: STANDEXMEDER; subpart_no: 1; Origin Footprint: RELAY-TH_STANDEXMEDER_DIP05-1C90-51L; Contributor: jordanjin; Convert to PCB: yes; UniqueId: gge32902d80266dcdbb; ModelId: 9ce20f042c4243a9be1ebcff3b9f4bf9; Device: Реле герконовое DIP05-1C90-51L [PCB]; Symbol: Реле герконовое DIP05-1C90-51L [PCB]; Supplier: LCSC; Manufacturer Part: DIP05-1C90-51L; JLCPCB Part Class: Extended Part; spicePre: K; spiceSymbolName: Реле герконовое DIP05-1C90-51L [PCB]; Add into BOM: yes; FootprintName: RELAY-TH_STANDEXMEDER_DIP05-1C90-51L; ModelName: RELAY-TH_STANDEXMEDER_DIP05-1C90-51L
LED? = FYLS-0805UBC: LED; Manufacturer_Name: Foryard; Datasheet Link: https://v4.cecdn.yun300.cn/100001_2003185297/11%20FYLS-0805XXXC-D.pdf; Height: 0.9mm; Manufacturer_Part_Number: FYLS-0805UBC
R101 = Резистор 100Ом 0,125Вт 1% [0805]: Contributor: jordanjin; Convert to PCB: yes; UniqueId: gge8e69174dfe8de139; ModelId: de27d504f5024d53a3020ec2611f5e5e; Origin Footprint: R0805; Device: Резистор 100Ом 0,125Вт 1% [0805]; Symbol: Резистор 100Ом 0,125Вт 1% [0805]; Manufacturer Part: R0805; spicePre: R; spiceSymbolName: Резистор 12кОм 0,125Вт 1% [0805]; Add into BOM: yes; FootprintName: R0805; ModelName: R0805
R102 = Резистор 12кОм 0,125Вт 1% [0805]: Contributor: jordanjin; Convert to PCB: yes; UniqueId: gge3593b5a987344394; ModelId: de27d504f5024d53a3020ec2611f5e5e; Origin Footprint: R0805; Device: Резистор 12кОм 0,125Вт 1% [0805]; Symbol: Резистор 12кОм 0,125Вт 1% [0805]; Manufacturer Part: R0805; spicePre: R; spiceSymbolName: Резистор 12кОм 0,125Вт 1% [0805]; Add into BOM: yes; FootprintName: R0805; ModelName: R0805
R103 = Резистор 100Ом 0,125Вт 1% [0805]: Contributor: jordanjin; Convert to PCB: yes; UniqueId: ggea83a839db35ba597; ModelId: de27d504f5024d53a3020ec2611f5e5e; Origin Footprint: R0805; Device: Резистор 100Ом 0,125Вт 1% [0805]; Symbol: Резистор 100Ом 0,125Вт 1% [0805]; Manufacturer Part: R0805; spicePre: R; spiceSymbolName: Резистор 12кОм 0,125Вт 1% [0805]; Add into BOM: yes; FootprintName: R0805; ModelName: R0805
R104 = Резистор 12кОм 0,125Вт 1% [0805]: Contributor: jordanjin; Convert to PCB: yes; UniqueId: gge34205e959e161e99; ModelId: de27d504f5024d53a3020ec2611f5e5e; Origin Footprint: R0805; Device: Резистор 12кОм 0,125Вт 1% [0805]; Symbol: Резистор 12кОм 0,125Вт 1% [0805]; Manufacturer Part: R0805; spicePre: R; spiceSymbolName: Резистор 12кОм 0,125Вт 1% [0805]; Add into BOM: yes; FootprintName: R0805; ModelName: R0805
R105 = Резистор 100Ом 0,125Вт 1% [0805]: Contributor: jordanjin; Convert to PCB: yes; UniqueId: gge9e8368af3e05dccc; ModelId: de27d504f5024d53a3020ec2611f5e5e; Origin Footprint: R0805; Device: Резистор 100Ом 0,125Вт 1% [0805]; Symbol: Резистор 100Ом 0,125Вт 1% [0805]; Manufacturer Part: R0805; spicePre: R; spiceSymbolName: Резистор 12кОм 0,125Вт 1% [0805]; Add into BOM: yes; FootprintName: R0805; ModelName: R0805
R106 = Резистор 12кОм 0,125Вт 1% [0805]: Contributor: jordanjin; Convert to PCB: yes; UniqueId: gge6a20c8c131949399; ModelId: de27d504f5024d53a3020ec2611f5e5e; Origin Footprint: R0805; Device: Резистор 12кОм 0,125Вт 1% [0805]; Symbol: Резистор 12кОм 0,125Вт 1% [0805]; Manufacturer Part: R0805; spicePre: R; spiceSymbolName: Резистор 12кОм 0,125Вт 1% [0805]; Add into BOM: yes; FootprintName: R0805; ModelName: R0805
R107 = Резистор 100Ом 0,125Вт 1% [0805]: Contributor: jordanjin; Convert to PCB: yes; UniqueId: gge91e711025a308bb8; ModelId: de27d504f5024d53a3020ec2611f5e5e; Origin Footprint: R0805; Device: Резистор 100Ом 0,125Вт 1% [0805]; Symbol: Резистор 100Ом 0,125Вт 1% [0805]; Manufacturer Part: R0805; spicePre: R; spiceSymbolName: Резистор 12кОм 0,125Вт 1% [0805]; Add into BOM: yes; FootprintName: R0805; ModelName: R0805
R108 = Резистор 12кОм 0,125Вт 1% [0805]: Contributor: jordanjin; Convert to PCB: yes; UniqueId: ggeb50d050c0c15c8f5; ModelId: de27d504f5024d53a3020ec2611f5e5e; Origin Footprint: R0805; Device: Резистор 12кОм 0,125Вт 1% [0805]; Symbol: Резистор 12кОм 0,125Вт 1% [0805]; Manufacturer Part: R0805; spicePre: R; spiceSymbolName: Резистор 12кОм 0,125Вт 1% [0805]; Add into BOM: yes; FootprintName: R0805; ModelName: R0805
R109 = Резистор 100Ом 0,125Вт 1% [0805]: Contributor: jordanjin; Convert to PCB: yes; UniqueId: gge40888de84444f326; ModelId: de27d504f5024d53a3020ec2611f5e5e; Origin Footprint: R0805; Device: Резистор 100Ом 0,125Вт 1% [0805]; Symbol: Резистор 100Ом 0,125Вт 1% [0805]; Manufacturer Part: R0805; spicePre: R; spiceSymbolName: Резистор 12кОм 0,125Вт 1% [0805]; Add into BOM: yes; FootprintName: R0805; ModelName: R0805
R110 = Резистор 12кОм 0,125Вт 1% [0805]: Contributor: jordanjin; Convert to PCB: yes; UniqueId: gge5e816858bb71df28; ModelId: de27d504f5024d53a3020ec2611f5e5e; Origin Footprint: R0805; Device: Резистор 12кОм 0,125Вт 1% [0805]; Symbol: Резистор 12кОм 0,125Вт 1% [0805]; Manufacturer Part: R0805; spicePre: R; spiceSymbolName: Резистор 12кОм 0,125Вт 1% [0805]; Add into BOM: yes; FootprintName: R0805; ModelName: R0805
R111 = Резистор 100Ом 0,125Вт 1% [0805]: Contributor: jordanjin; Convert to PCB: yes; UniqueId: gge4668ab4809823d7c; ModelId: de27d504f5024d53a3020ec2611f5e5e; Origin Footprint: R0805; Device: Резистор 100Ом 0,125Вт 1% [0805]; Symbol: Резистор 100Ом 0,125Вт 1% [0805]; Manufacturer Part: R0805; spicePre: R; spiceSymbolName: Резистор 12кОм 0,125Вт 1% [0805]; Add into BOM: yes; FootprintName: R0805; ModelName: R0805
R112 = Резистор 12кОм 0,125Вт 1% [0805]: Contributor: jordanjin; Convert to PCB: yes; UniqueId: gge6d03b156add52f59; ModelId: de27d504f5024d53a3020ec2611f5e5e; Origin Footprint: R0805; Device: Резистор 12кОм 0,125Вт 1% [0805]; Symbol: Резистор 12кОм 0,125Вт 1% [0805]; Manufacturer Part: R0805; spicePre: R; spiceSymbolName: Резистор 12кОм 0,125Вт 1% [0805]; Add into BOM: yes; FootprintName: R0805; ModelName: R0805
R113 = Резистор 1кОм 0,125Вт 1% [0805]: Contributor: jordanjin; Convert to PCB: yes; UniqueId: ggefc65a99cb1671a37; ModelId: de27d504f5024d53a3020ec2611f5e5e; Origin Footprint: R0805; Device: Резистор 1кОм 0,125Вт 1% [0805]; Symbol: Резистор 1кОм 0,125Вт 1% [0805]; Manufacturer Part: R0805; spicePre: R; spiceSymbolName: Резистор 12кОм 0,125Вт 1% [0805]; Add into BOM: yes; FootprintName: R0805; ModelName: R0805
R114 = Резистор 1кОм 0,125Вт 1% [0805]: Contributor: jordanjin; Convert to PCB: yes; UniqueId: ggec2b6080563c7f1a9; ModelId: de27d504f5024d53a3020ec2611f5e5e; Origin Footprint: R0805; Device: Резистор 1кОм 0,125Вт 1% [0805]; Symbol: Резистор 1кОм 0,125Вт 1% [0805]; Manufacturer Part: R0805; spicePre: R; spiceSymbolName: Резистор 12кОм 0,125Вт 1% [0805]; Add into BOM: yes; FootprintName: R0805; ModelName: R0805
R115 = Резистор 1кОм 0,125Вт 1% [0805]: Contributor: jordanjin; Convert to PCB: yes; UniqueId: gge64c21d50f88cd611; ModelId: de27d504f5024d53a3020ec2611f5e5e; Origin Footprint: R0805; Device: Резистор 1кОм 0,125Вт 1% [0805]; Symbol: Резистор 1кОм 0,125Вт 1% [0805]; Manufacturer Part: R0805; spicePre: R; spiceSymbolName: Резистор 12кОм 0,125Вт 1% [0805]; Add into BOM: yes; FootprintName: R0805; ModelName: R0805
R116 = Резистор 1кОм 0,125Вт 1% [0805]: Contributor: jordanjin; Convert to PCB: yes; UniqueId: gge7a48b93cbe1f66c7; ModelId: de27d504f5024d53a3020ec2611f5e5e; Origin Footprint: R0805; Device: Резистор 1кОм 0,125Вт 1% [0805]; Symbol: Резистор 1кОм 0,125Вт 1% [0805]; Manufacturer Part: R0805; spicePre: R; spiceSymbolName: Резистор 12кОм 0,125Вт 1% [0805]; Add into BOM: yes; FootprintName: R0805; ModelName: R0805
R117 = Резистор 100Ом 0,125Вт 1% [0805]: Contributor: jordanjin; Convert to PCB: yes; UniqueId: gge264200b346de9972; ModelId: de27d504f5024d53a3020ec2611f5e5e; Origin Footprint: R0805; Device: Резистор 100Ом 0,125Вт 1% [0805]; Symbol: Резистор 100Ом 0,125Вт 1% [0805]; Manufacturer Part: R0805; spicePre: R; spiceSymbolName: Резистор 12кОм 0,125Вт 1% [0805]; Add into BOM: yes; FootprintName: R0805; ModelName: R0805
R118 = Резистор 100Ом 0,125Вт 1% [0805]: Contributor: jordanjin; Convert to PCB: yes; UniqueId: gge07eaf7a8f1643a1b; ModelId: de27d504f5024d53a3020ec2611f5e5e; Origin Footprint: R0805; Device: Резистор 100Ом 0,125Вт 1% [0805]; Symbol: Резистор 100Ом 0,125Вт 1% [0805]; Manufacturer Part: R0805; spicePre: R; spiceSymbolName: Резистор 12кОм 0,125Вт 1% [0805]; Add into BOM: yes; FootprintName: R0805; ModelName: R0805
R119 = Резистор 100Ом 0,125Вт 1% [0805]: Contributor: jordanjin; Convert to PCB: yes; UniqueId: gge6de872c1c3061c0f; ModelId: de27d504f5024d53a3020ec2611f5e5e; Origin Footprint: R0805; Device: Резистор 100Ом 0,125Вт 1% [0805]; Symbol: Резистор 100Ом 0,125Вт 1% [0805]; Manufacturer Part: R0805; spicePre: R; spiceSymbolName: Резистор 12кОм 0,125Вт 1% [0805]; Add into BOM: yes; FootprintName: R0805; ModelName: R0805
R120 = Резистор 100Ом 0,125Вт 1% [0805]: Contributor: jordanjin; Convert to PCB: yes; UniqueId: gge98a8f3e179b6914a; ModelId: de27d504f5024d53a3020ec2611f5e5e; Origin Footprint: R0805; Device: Резистор 100Ом 0,125Вт 1% [0805]; Symbol: Резистор 100Ом 0,125Вт 1% [0805]; Manufacturer Part: R0805; spicePre: R; spiceSymbolName: Резистор 12кОм 0,125Вт 1% [0805]; Add into BOM: yes; FootprintName: R0805; ModelName: R0805
R121 = Резистор 100Ом 0,125Вт 1% [0805]: Contributor: jordanjin; Convert to PCB: yes; UniqueId: ggefbb83fafa60225a0; ModelId: de27d504f5024d53a3020ec2611f5e5e; Origin Footprint: R0805; Device: Резистор 100Ом 0,125Вт 1% [0805]; Symbol: Резистор 100Ом 0,125Вт 1% [0805]; Manufacturer Part: R0805; spicePre: R; spiceSymbolName: Резистор 12кОм 0,125Вт 1% [0805]; Add into BOM: yes; FootprintName: R0805; ModelName: R0805
R122 = Резистор 100Ом 0,125Вт 1% [0805]: Contributor: jordanjin; Convert to PCB: yes; UniqueId: gge47069d7b29d0598f; ModelId: de27d504f5024d53a3020ec2611f5e5e; Origin Footprint: R0805; Device: Резистор 100Ом 0,125Вт 1% [0805]; Symbol: Резистор 100Ом 0,125Вт 1% [0805]; Manufacturer Part: R0805; spicePre: R; spiceSymbolName: Резистор 12кОм 0,125Вт 1% [0805]; Add into BOM: yes; FootprintName: R0805; ModelName: R0805
R123 = Резистор 100Ом 0,125Вт 1% [0805]: Contributor: jordanjin; Convert to PCB: yes; UniqueId: gge0a68d2064838e57a; ModelId: de27d504f5024d53a3020ec2611f5e5e; Origin Footprint: R0805; Device: Резистор 100Ом 0,125Вт 1% [0805]; Symbol: Резистор 100Ом 0,125Вт 1% [0805]; Manufacturer Part: R0805; spicePre: R; spiceSymbolName: Резистор 12кОм 0,125Вт 1% [0805]; Add into BOM: yes; FootprintName: R0805; ModelName: R0805
R124 = Резистор 100Ом 0,125Вт 1% [0805]: Contributor: jordanjin; Convert to PCB: yes; UniqueId: gge2ad18ecfa8157ebd; ModelId: de27d504f5024d53a3020ec2611f5e5e; Origin Footprint: R0805; Device: Резистор 100Ом 0,125Вт 1% [0805]; Symbol: Резистор 100Ом 0,125Вт 1% [0805]; Manufacturer Part: R0805; spicePre: R; spiceSymbolName: Резистор 12кОм 0,125Вт 1% [0805]; Add into BOM: yes; FootprintName: R0805; ModelName: R0805
R125 = Резистор 100Ом 0,125Вт 1% [0805]: Contributor: jordanjin; Convert to PCB: yes; UniqueId: ggeed29cd528e8221e7; ModelId: de27d504f5024d53a3020ec2611f5e5e; Origin Footprint: R0805; Device: Резистор 100Ом 0,125Вт 1% [0805]; Symbol: Резистор 100Ом 0,125Вт 1% [0805]; Manufacturer Part: R0805; spicePre: R; spiceSymbolName: Резистор 12кОм 0,125Вт 1% [0805]; Add into BOM: yes; FootprintName: R0805; ModelName: R0805
R126 = Резистор 100Ом 0,125Вт 1% [0805]: Contributor: jordanjin; Convert to PCB: yes; UniqueId: ggeb84eb3975a3fb34b; ModelId: de27d504f5024d53a3020ec2611f5e5e; Origin Footprint: R0805; Device: Резистор 100Ом 0,125Вт 1% [0805]; Symbol: Резистор 100Ом 0,125Вт 1% [0805]; Manufacturer Part: R0805; spicePre: R; spiceSymbolName: Резистор 12кОм 0,125Вт 1% [0805]; Add into BOM: yes; FootprintName: R0805; ModelName: R0805
R127 = Резистор 100Ом 0,125Вт 1% [0805]: Contributor: jordanjin; Convert to PCB: yes; UniqueId: gge1de39afe1abf2d5f; ModelId: de27d504f5024d53a3020ec2611f5e5e; Origin Footprint: R0805; Device: Резистор 100Ом 0,125Вт 1% [0805]; Symbol: Резистор 100Ом 0,125Вт 1% [0805]; Manufacturer Part: R0805; spicePre: R; spiceSymbolName: Резистор 12кОм 0,125Вт 1% [0805]; Add into BOM: yes; FootprintName: R0805; ModelName: R0805
R128 = Резистор 100Ом 0,125Вт 1% [DIP]: Origin Footprint: R0.125W; Contributor: jordanjin; Convert to PCB: yes; UniqueId: gge4e9655f68a8dafce; Device: Резистор 100Ом 0,125Вт 1% [DIP]; Symbol: Резистор 100Ом 0,125Вт 1% [DIP]; Manufacturer Part: R0805; spicePre: R; spiceSymbolName: Резистор 100Ом 0,125Вт 1% [DIP]; Add into BOM: yes
R129 = Резистор 100Ом 0,125Вт 1% [0805]: Contributor: jordanjin; Convert to PCB: yes; UniqueId: gge15c989a1a56d1139; ModelId: de27d504f5024d53a3020ec2611f5e5e; Origin Footprint: R0805; Device: Резистор 100Ом 0,125Вт 1% [0805]; Symbol: Резистор 100Ом 0,125Вт 1% [0805]; Manufacturer Part: R0805; spicePre: R; spiceSymbolName: Резистор 12кОм 0,125Вт 1% [0805]; Add into BOM: yes; FootprintName: R0805; ModelName: R0805
R130 = Резистор 100Ом 0,125Вт 1% [DIP]: Origin Footprint: R0.125W; Contributor: jordanjin; Convert to PCB: yes; UniqueId: gge4dae1ceed1638d27; Device: Резистор 100Ом 0,125Вт 1% [DIP]; Symbol: Резистор 100Ом 0,125Вт 1% [DIP]; Manufacturer Part: R0805; spicePre: R; spiceSymbolName: Резистор 100Ом 0,125Вт 1% [DIP]; Add into BOM: yes
R131 = Резистор 100Ом 0,125Вт 1% [0805]: Contributor: jordanjin; Convert to PCB: yes; UniqueId: ggee0de59b0d0accf9e; ModelId: de27d504f5024d53a3020ec2611f5e5e; Origin Footprint: R0805; Device: Резистор 100Ом 0,125Вт 1% [0805]; Symbol: Резистор 100Ом 0,125Вт 1% [0805]; Manufacturer Part: R0805; spicePre: R; spiceSymbolName: Резистор 12кОм 0,125Вт 1% [0805]; Add into BOM: yes; FootprintName: R0805; ModelName: R0805
R132 = Резистор 100Ом 0,125Вт 1% [DIP]: Origin Footprint: R0.125W; Contributor: jordanjin; Convert to PCB: yes; UniqueId: ggee36e9b7f0e93b298; Device: Резистор 100Ом 0,125Вт 1% [DIP]; Symbol: Резистор 100Ом 0,125Вт 1% [DIP]; Manufacturer Part: R0805; spicePre: R; spiceSymbolName: Резистор 100Ом 0,125Вт 1% [DIP]; Add into BOM: yes
R133 = Резистор 100Ом 0,125Вт 1% [0805]: Contributor: jordanjin; Convert to PCB: yes; UniqueId: gge983ca56eedb453e4; ModelId: de27d504f5024d53a3020ec2611f5e5e; Origin Footprint: R0805; Device: Резистор 100Ом 0,125Вт 1% [0805]; Symbol: Резистор 100Ом 0,125Вт 1% [0805]; Manufacturer Part: R0805; spicePre: R; spiceSymbolName: Резистор 12кОм 0,125Вт 1% [0805]; Add into BOM: yes; FootprintName: R0805; ModelName: R0805
R134 = Резистор 100Ом 0,125Вт 1% [DIP]: Origin Footprint: R0.125W; Contributor: jordanjin; Convert to PCB: yes; UniqueId: gge3d38ae09e62b8b32; Device: Резистор 100Ом 0,125Вт 1% [DIP]; Symbol: Резистор 100Ом 0,125Вт 1% [DIP]; Manufacturer Part: R0805; spicePre: R; spiceSymbolName: Резистор 100Ом 0,125Вт 1% [DIP]; Add into BOM: yes
R135 = Резистор 100Ом 0,125Вт 1% [0805]: Contributor: jordanjin; Convert to PCB: yes; UniqueId: gge09ad5689e5294181; ModelId: de27d504f5024d53a3020ec2611f5e5e; Origin Footprint: R0805; Device: Резистор 100Ом 0,125Вт 1% [0805]; Symbol: Резистор 100Ом 0,125Вт 1% [0805]; Manufacturer Part: R0805; spicePre: R; spiceSymbolName: Резистор 12кОм 0,125Вт 1% [0805]; Add into BOM: yes; FootprintName: R0805; ModelName: R0805
R136 = Резистор 100Ом 0,125Вт 1% [DIP]: Origin Footprint: R0.125W; Contributor: jordanjin; Convert to PCB: yes; UniqueId: gge2dab259ff1c17ce2; Device: Резистор 100Ом 0,125Вт 1% [DIP]; Symbol: Резистор 100Ом 0,125Вт 1% [DIP]; Manufacturer Part: R0805; spicePre: R; spiceSymbolName: Резистор 100Ом 0,125Вт 1% [DIP]; Add into BOM: yes
R137 = Резистор 100Ом 0,125Вт 1% [0805]: Contributor: jordanjin; Convert to PCB: yes; UniqueId: gge06fa5f47d91d6bb1; ModelId: de27d504f5024d53a3020ec2611f5e5e; Origin Footprint: R0805; Device: Резистор 100Ом 0,125Вт 1% [0805]; Symbol: Резистор 100Ом 0,125Вт 1% [0805]; Manufacturer Part: R0805; spicePre: R; spiceSymbolName: Резистор 12кОм 0,125Вт 1% [0805]; Add into BOM: yes; FootprintName: R0805; ModelName: R0805
R138 = Резистор 100Ом 0,125Вт 1% [DIP]: Origin Footprint: R0.125W; Contributor: jordanjin; Convert to PCB: yes; UniqueId: ggef6bf27152fd71dfe; Device: Резистор 100Ом 0,125Вт 1% [DIP]; Symbol: Резистор 100Ом 0,125Вт 1% [DIP]; Manufacturer Part: R0805; spicePre: R; spiceSymbolName: Резистор 100Ом 0,125Вт 1% [DIP]; Add into BOM: yes
R139 = Резистор 100Ом 0,125Вт 1% [0805]: Contributor: jordanjin; Convert to PCB: yes; UniqueId: gge8d46e455117a8b37; ModelId: de27d504f5024d53a3020ec2611f5e5e; Origin Footprint: R0805; Device: Резистор 100Ом 0,125Вт 1% [0805]; Symbol: Резистор 100Ом 0,125Вт 1% [0805]; Manufacturer Part: R0805; spicePre: R; spiceSymbolName: Резистор 12кОм 0,125Вт 1% [0805]; Add into BOM: yes; FootprintName: R0805; ModelName: R0805
R140 = Резистор 100Ом 0,125Вт 1% [DIP]: Origin Footprint: R0.125W; Contributor: jordanjin; Convert to PCB: yes; UniqueId: gge4ec196be36a645b6; Device: Резистор 100Ом 0,125Вт 1% [DIP]; Symbol: Резистор 100Ом 0,125Вт 1% [DIP]; Manufacturer Part: R0805; spicePre: R; spiceSymbolName: Резистор 100Ом 0,125Вт 1% [DIP]; Add into BOM: yes
R141 = Резистор 100Ом 0,125Вт 1% [0805]: Contributor: jordanjin; Convert to PCB: yes; UniqueId: gge9aeb16e17deead7c; ModelId: de27d504f5024d53a3020ec2611f5e5e; Origin Footprint: R0805; Device: Резистор 100Ом 0,125Вт 1% [0805]; Symbol: Резистор 100Ом 0,125Вт 1% [0805]; Manufacturer Part: R0805; spicePre: R; spiceSymbolName: Резистор 12кОм 0,125Вт 1% [0805]; Add into BOM: yes; FootprintName: R0805; ModelName: R0805
R142 = Резистор 100Ом 0,125Вт 1% [DIP]: Origin Footprint: R0.125W; Contributor: jordanjin; Convert to PCB: yes; UniqueId: gge15ebc2f7908fa8bd; Device: Резистор 100Ом 0,125Вт 1% [DIP]; Symbol: Резистор 100Ом 0,125Вт 1% [DIP]; Manufacturer Part: R0805; spicePre: R; spiceSymbolName: Резистор 100Ом 0,125Вт 1% [DIP]; Add into BOM: yes
R143 = Резистор 100Ом 0,125Вт 1% [0805]: Contributor: jordanjin; Convert to PCB: yes; UniqueId: gge284a2cddc6cc5500; ModelId: de27d504f5024d53a3020ec2611f5e5e; Origin Footprint: R0805; Device: Резистор 100Ом 0,125Вт 1% [0805]; Symbol: Резистор 100Ом 0,125Вт 1% [0805]; Manufacturer Part: R0805; spicePre: R; spiceSymbolName: Резистор 12кОм 0,125Вт 1% [0805]; Add into BOM: yes; FootprintName: R0805; ModelName: R0805